# Altium schematic sheet SD Card Block.SchDoc: SD Card Block
size 292 x 193 mm; SheetNumber: 26; SheetTotal: 28
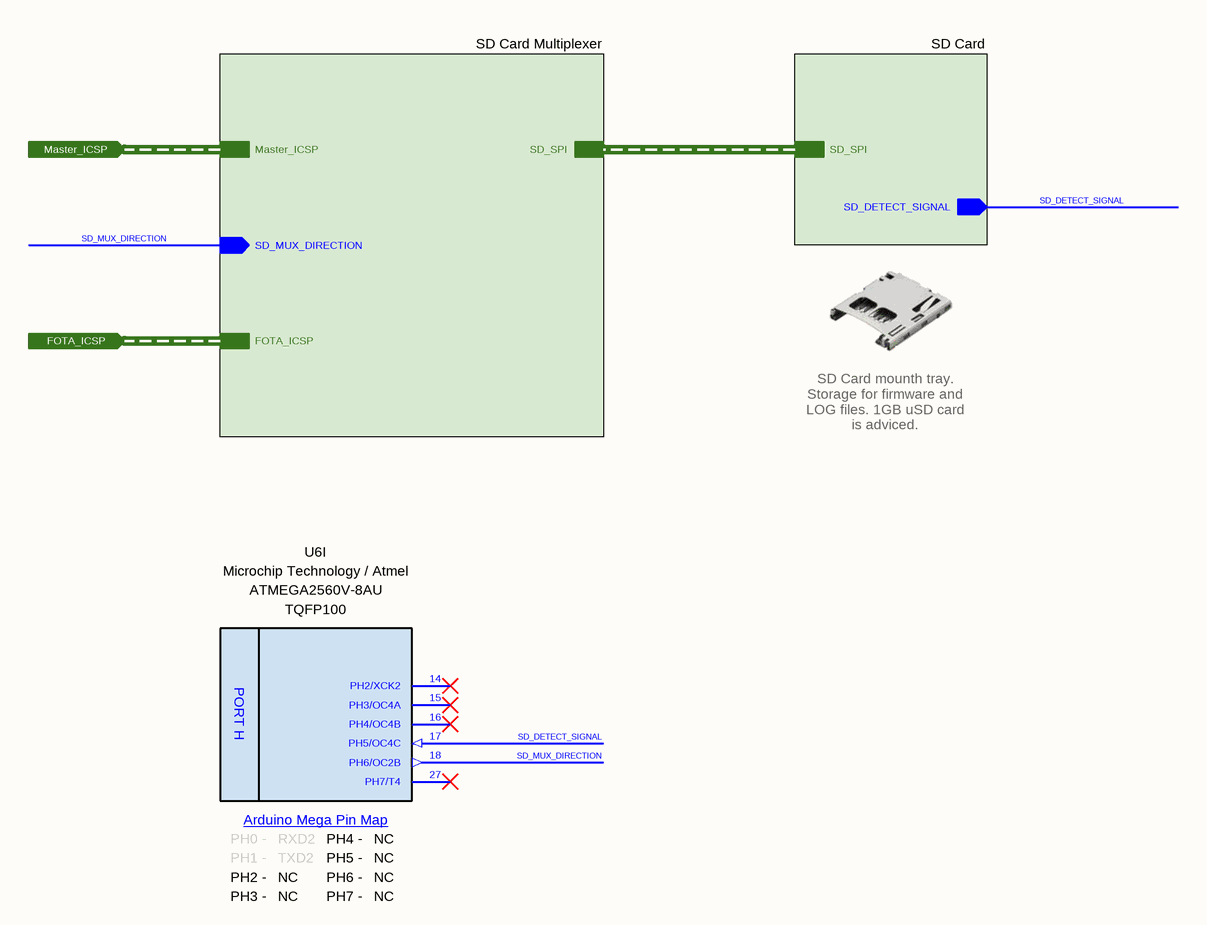
[diagram p0: SD Card Block.SchDoc]

## Parts
U6  Manufacturer Name: Microchip Technology / Atmel  Case: TQFP100  [TQFP-100]  (hidden comment: ATMEGA2560V-8AU)  (part I of 16)

## Sub-sheets
SD Card = SD Card.SchDoc: SD_SPI (harness SD_SPI), SD_DETECT_SIGNAL (out)
SD Card Multiplexer = SD Card Multiplexer.SchDoc: Master_ICSP (harness Master_ICSP), FOTA_ICSP (harness FOTA_ICSP), SD_SPI (harness SD_SPI), SD_MUX_DIRECTION (in)

## Ports
FOTA_ICSP (in, harness FOTA_ICSP), Master_ICSP (in, harness Master_ICSP)

## Nets
SD_DETECT_SIGNAL: U6.17(PH5/OC4C) ; sheet SD Card/SD_DETECT_SIGNAL
SD_MUX_DIRECTION: U6.18(PH6/OC2B) ; sheet SD Card Multiplexer/SD_MUX_DIRECTION

Not connected (* = marked no-connect by the designer): U6 14(PH2/XCK2)* 15(PH3/OC4A)* 16(PH4/OC4B)* 27(PH7/T4)*

## Buses and harness runs
harness port FOTA_ICSP = sheet SD Card Multiplexer/FOTA_ICSP
harness port Master_ICSP = sheet SD Card Multiplexer/Master_ICSP
harness sheet SD Card Multiplexer/SD_SPI = sheet SD Card/SD_SPI

## Notes on the sheet
- SD Card mounth tray. Storage for firmware and LOG files. 1GB uSD card is adviced.
- © 2021 All rights reserved.
  This document may not, in whole or in part, be copied, photocopied, reproduced, translated or converted to any electronic or machine readable from without prior written permission of Mehmet Günce Akkoyun.
  Engineer contact : akkoyun@me.com
- Property of
- Engineer :
- Date :
- Size :
- A4
- Time :
- Project :
- Page :
- /
- Customer :
- Product ID :
- Module ID :
- Version :
- File :
- Revision :
- (in symbol IC - AtMega2560V-8AU, part I) PORT H; Arduino Mega Pin Map; PH0 -; PH4 -; NC; PH1 -; PH5 -; PH2 -; PH6 -; PH3 -; PH7 -

## Library data of the parts
U6 = IC - AtMega2560V-8AU: ATmega Series 256 KB Flash 8 KB SRAM 8 MHz 8-Bit Microcontroller - TQFP-100; Program Memory Size: 256 kB; Core: AVR; Operating Supply Voltage: 2.7 V to 5.5 V; Maximum Clock Frequency: 8 MHz; Maximum Operating Temperature: + 85 C; Product Type: MicroControllers; Minimum Operating Temperature: - 40 C; Manufacturer Part Number: ATMEGA2560V-8AU